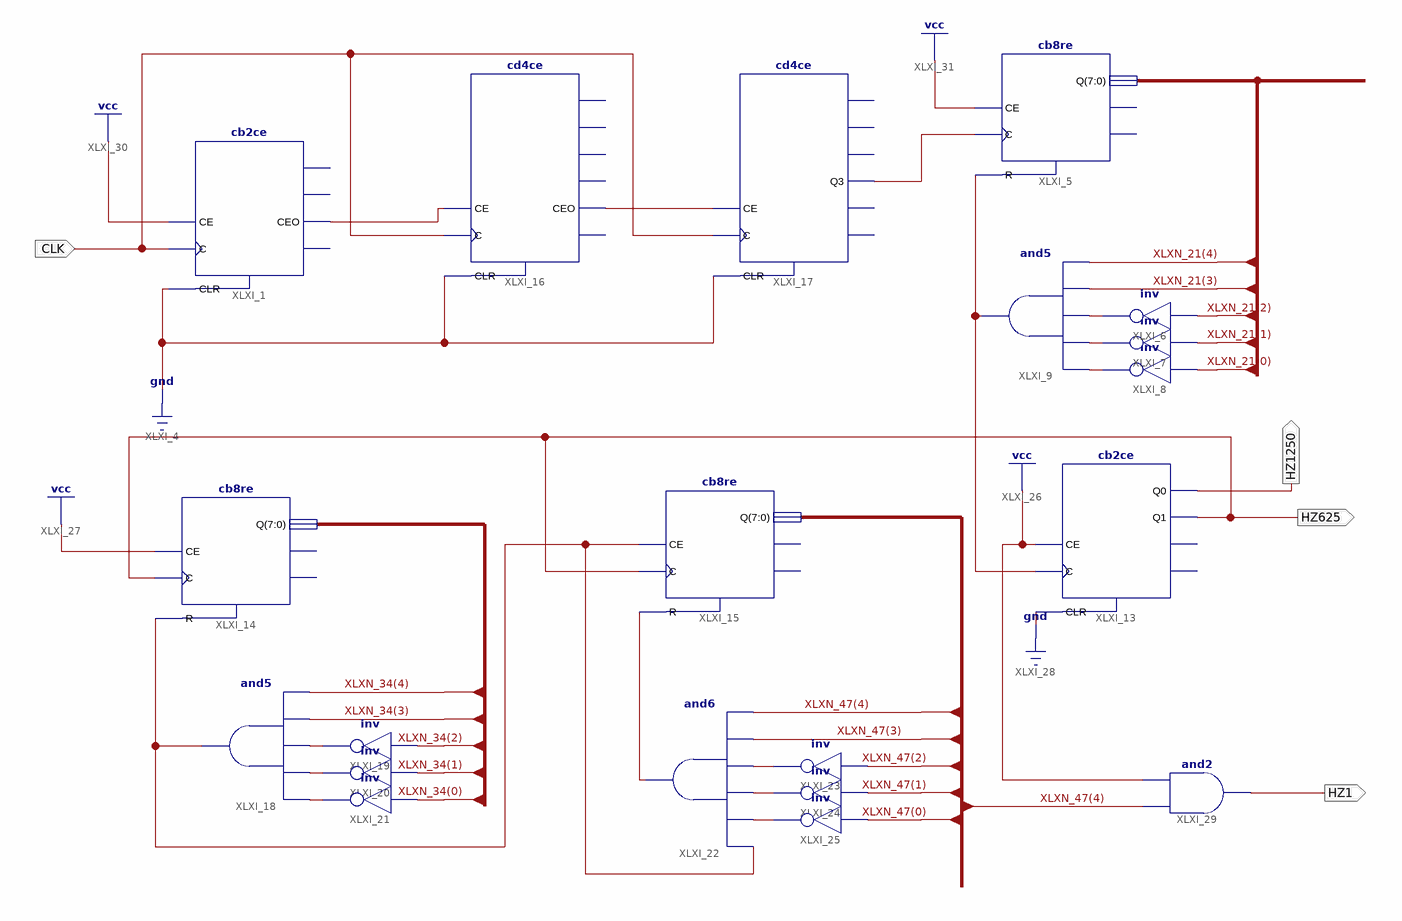
[diagram p0: schematic sheet 1]
// Xilinx ISE schematic frequenzy.sch (spartan3) as structural Verilog: 20 symbols, 4 ports
module frequenzy (
  input  CLK,
  output HZ625,
  output HZ1250,
  output HZ1
);

  wire XLXN_6, XLXN_7, XLXN_16, XLXN_17, XLXN_19, XLXN_20, XLXN_22, XLXN_35, XLXN_36, XLXN_37, XLXN_45,
       XLXN_48, XLXN_49, XLXN_50, XLXN_60;
  wire [7:0] XLXN_21, XLXN_34, XLXN_47;

  cb2ce XLXI_1 (.C(CLK), .CE(1'b1), .CLR(1'b0), .CEO(XLXN_6));  // open: Q0, Q1, TC
  cb8re XLXI_5 (.C(XLXN_20), .CE(1'b1), .R(XLXN_22), .Q(XLXN_21));  // open: CEO, TC
  not XLXI_6 (XLXN_19, XLXN_21[2]);
  not XLXI_7 (XLXN_17, XLXN_21[1]);
  not XLXI_8 (XLXN_16, XLXN_21[0]);
  and XLXI_9 (XLXN_22, XLXN_21[4], XLXN_21[3], XLXN_19, XLXN_17, XLXN_16);
  cb2ce XLXI_13 (.C(XLXN_22), .CE(1'b1), .CLR(1'b0), .Q0(HZ1250), .Q1(HZ625));  // open: CEO, TC
  cb8re XLXI_14 (.C(HZ625), .CE(1'b1), .R(XLXN_45), .Q(XLXN_34));  // open: CEO, TC
  cb8re XLXI_15 (.C(HZ625), .CE(XLXN_45), .R(XLXN_60), .Q(XLXN_47));  // open: CEO, TC
  cd4ce XLXI_16 (.C(CLK), .CE(XLXN_6), .CLR(1'b0), .CEO(XLXN_7));  // open: Q0, Q1, Q2, Q3, TC
  cd4ce XLXI_17 (.C(CLK), .CE(XLXN_7), .CLR(1'b0), .Q3(XLXN_20));  // open: CEO, Q0, Q1, Q2, TC
  and XLXI_18 (XLXN_45, XLXN_34[4], XLXN_34[3], XLXN_35, XLXN_36, XLXN_37);
  not XLXI_19 (XLXN_35, XLXN_34[2]);
  not XLXI_20 (XLXN_36, XLXN_34[1]);
  not XLXI_21 (XLXN_37, XLXN_34[0]);
  and XLXI_22 (XLXN_60, XLXN_47[4], XLXN_47[3], XLXN_48, XLXN_49, XLXN_50, XLXN_45);
  not XLXI_23 (XLXN_48, XLXN_47[2]);
  not XLXI_24 (XLXN_49, XLXN_47[1]);
  not XLXI_25 (XLXN_50, XLXN_47[0]);
  and XLXI_29 (HZ1, XLXN_47[4], 1'b1);
endmodule
